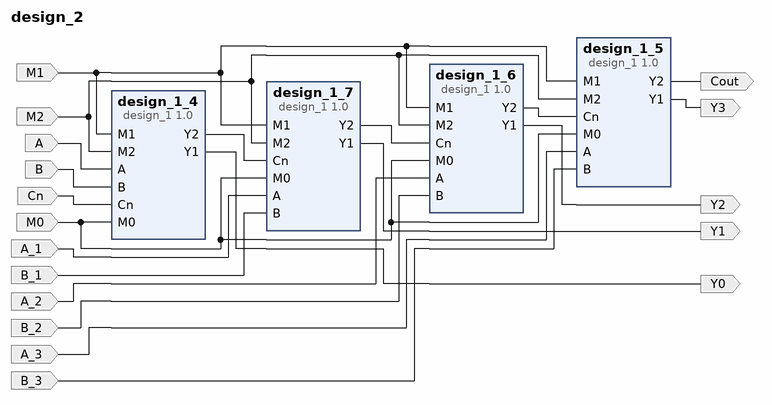
[diagram p0: block diagram of the top level]
# Vivado block design design_2, Vivado 2015.4
create_bd_design design_2

create_bd_port -dir I M1
create_bd_port -dir I M2
create_bd_port -dir I M0
create_bd_port -dir I Cn
create_bd_port -dir I B
create_bd_port -dir I A
create_bd_port -dir I A_1
create_bd_port -dir I B_1
create_bd_port -dir I A_2
create_bd_port -dir I B_2
create_bd_port -dir O Y0
create_bd_port -dir O Y1
create_bd_port -dir O Y2
create_bd_port -dir O Y3
create_bd_port -dir O Cout
create_bd_port -dir I A_3
create_bd_port -dir I B_3

create_bd_cell -type ip -vlnv sysu:user:design_1:1.0 design_1_4
create_bd_cell -type ip -vlnv sysu:user:design_1:1.0 design_1_5
create_bd_cell -type ip -vlnv sysu:user:design_1:1.0 design_1_6
create_bd_cell -type ip -vlnv sysu:user:design_1:1.0 design_1_7

# ---- connections ----

connect_bd_net -net M1_1 [get_bd_ports M1] \
  [get_bd_pins design_1_4/M1] [get_bd_pins design_1_7/M1] [get_bd_pins design_1_6/M1] [get_bd_pins design_1_5/M1]
connect_bd_net -net M2_1 [get_bd_ports M2] \
  [get_bd_pins design_1_4/M2] [get_bd_pins design_1_7/M2] [get_bd_pins design_1_6/M2] [get_bd_pins design_1_5/M2]
connect_bd_net -net M0_1 [get_bd_ports M0] \
  [get_bd_pins design_1_4/M0] [get_bd_pins design_1_7/M0] [get_bd_pins design_1_6/M0] [get_bd_pins design_1_5/M0]
connect_bd_net [get_bd_ports A] [get_bd_pins design_1_4/A]
connect_bd_net [get_bd_ports B] [get_bd_pins design_1_4/B]
connect_bd_net [get_bd_ports Cn] [get_bd_pins design_1_4/Cn]
connect_bd_net [get_bd_pins design_1_5/Y1] [get_bd_ports Y3]
connect_bd_net [get_bd_pins design_1_5/Y2] [get_bd_ports Cout]
connect_bd_net -net A_1_1 [get_bd_ports A_1] [get_bd_pins design_1_7/A]
connect_bd_net -net B_1_1 [get_bd_ports B_1] [get_bd_pins design_1_7/B]
connect_bd_net -net A_2_1 [get_bd_ports A_2] [get_bd_pins design_1_6/A]
connect_bd_net -net B_2_1 [get_bd_ports B_2] [get_bd_pins design_1_6/B]
connect_bd_net -net A_3_1 [get_bd_ports A_3] [get_bd_pins design_1_5/A]
connect_bd_net -net B_3_1 [get_bd_ports B_3] [get_bd_pins design_1_5/B]
connect_bd_net [get_bd_pins design_1_4/Y2] [get_bd_pins design_1_7/Cn]
connect_bd_net [get_bd_pins design_1_7/Y2] [get_bd_pins design_1_6/Cn]
connect_bd_net [get_bd_pins design_1_6/Y2] [get_bd_pins design_1_5/Cn]
connect_bd_net [get_bd_pins design_1_6/Y1] [get_bd_ports Y2]
connect_bd_net [get_bd_pins design_1_7/Y1] [get_bd_ports Y1]
connect_bd_net [get_bd_pins design_1_4/Y1] [get_bd_ports Y0]

validate_bd_design
save_bd_design
